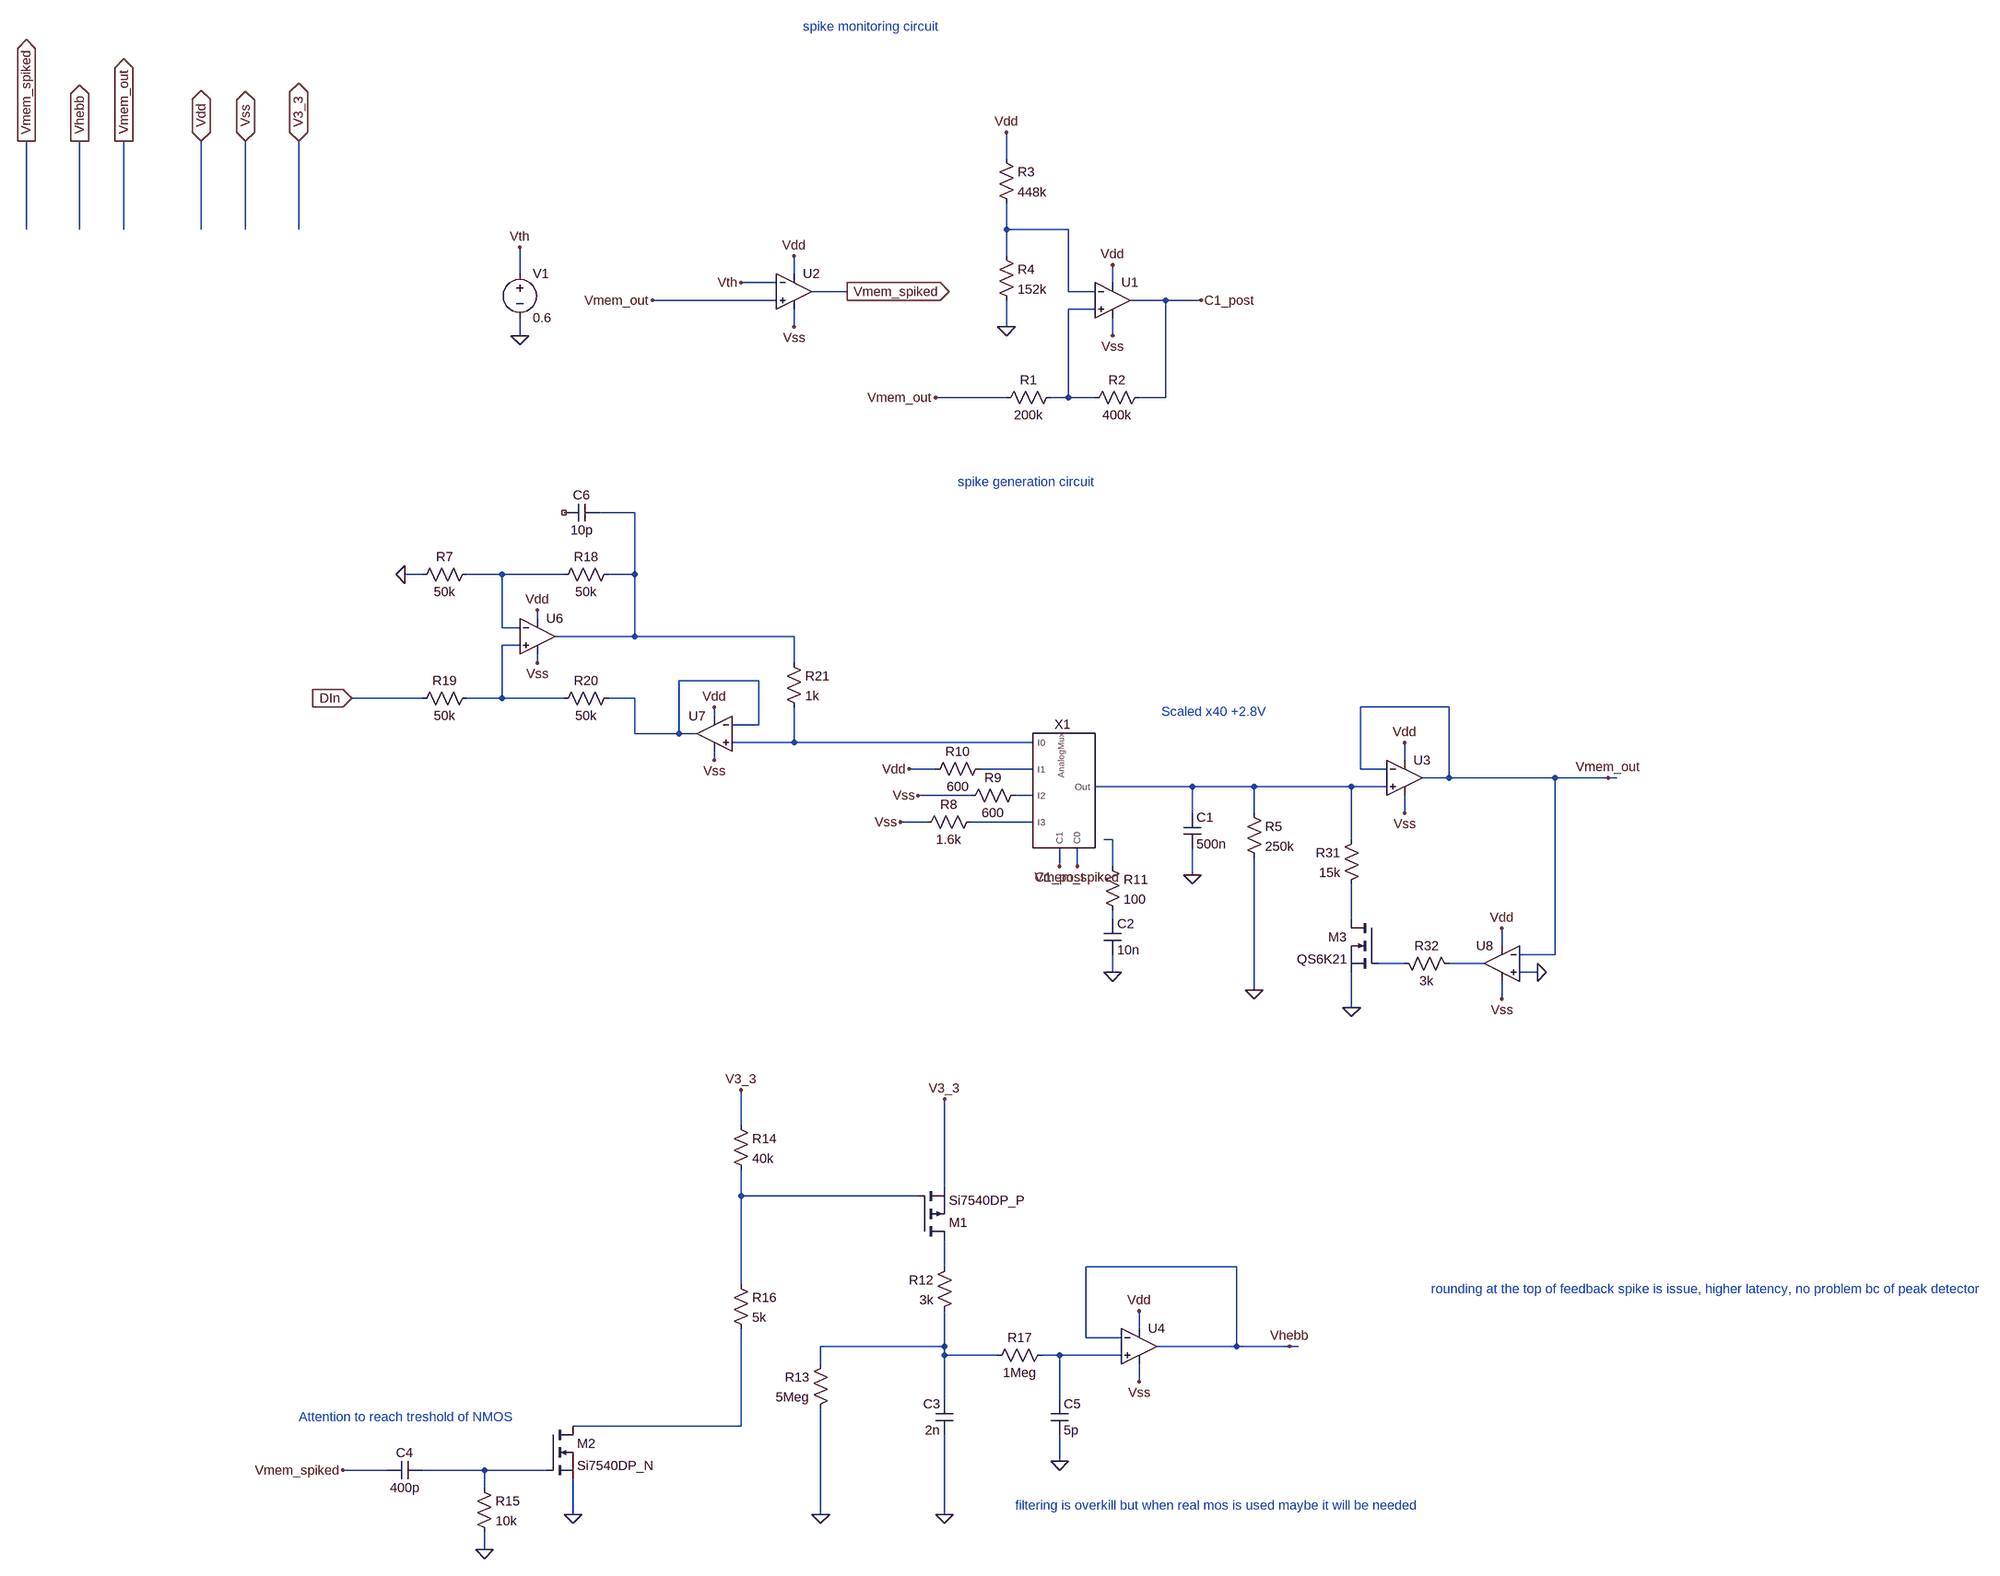
[diagram p0: schematic Digital_to_Spike.asc]
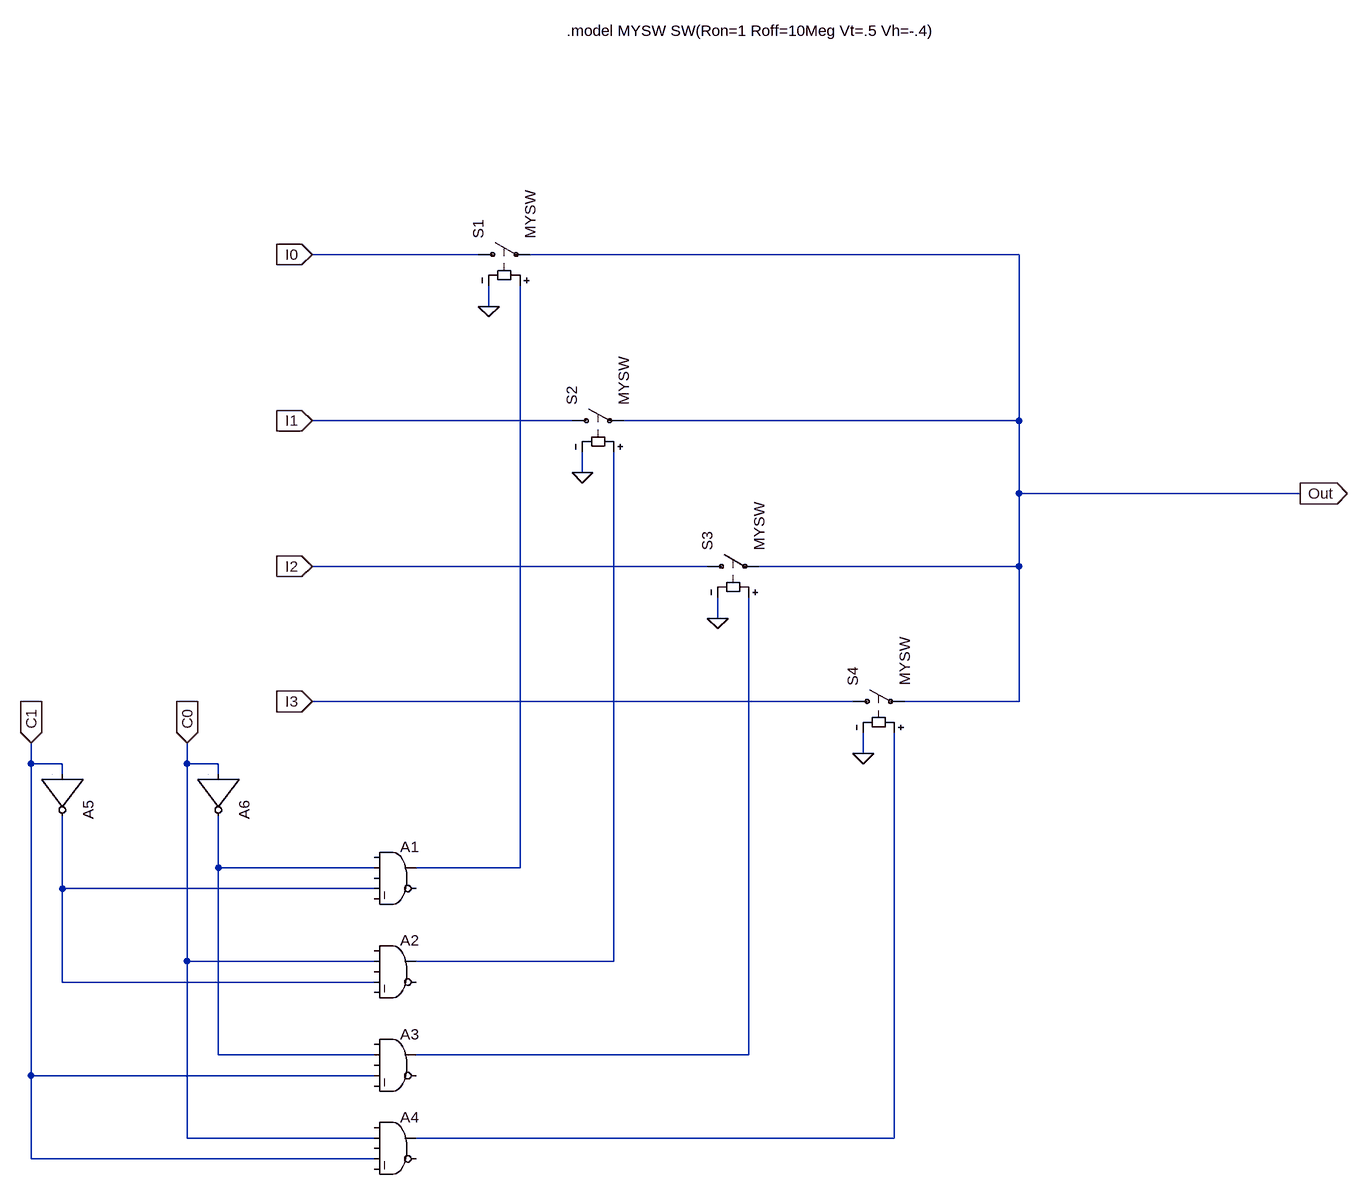
[diagram p1: sub-circuit analogmux.asc]
Digital_to_Spike.asc, the LTspice schematic file:
Version 4
SHEET 1 3772 2324
WIRE 1920 -1296 1920 -1344
WIRE 128 -1168 128 -1328
WIRE 224 -1168 224 -1328
WIRE 304 -1168 304 -1328
WIRE 464 -1168 464 -1328
WIRE 544 -1168 544 -1328
WIRE 640 -1168 640 -1328
WIRE 1920 -1168 1920 -1216
WIRE 2032 -1168 1920 -1168
WIRE 1920 -1120 1920 -1168
WIRE 1040 -1088 1040 -1136
WIRE 1536 -1088 1536 -1120
WIRE 1504 -1072 1440 -1072
WIRE 2112 -1072 2112 -1104
WIRE 1632 -1056 1568 -1056
WIRE 2032 -1056 2032 -1168
WIRE 2080 -1056 2032 -1056
WIRE 1504 -1040 1280 -1040
WIRE 2208 -1040 2144 -1040
WIRE 2272 -1040 2208 -1040
WIRE 2080 -1024 2032 -1024
WIRE 1536 -992 1536 -1024
WIRE 1920 -992 1920 -1040
WIRE 1040 -976 1040 -1008
WIRE 2112 -976 2112 -1008
WIRE 1920 -864 1792 -864
WIRE 2032 -864 2032 -1024
WIRE 2032 -864 2000 -864
WIRE 2080 -864 2032 -864
WIRE 2208 -864 2208 -1040
WIRE 2208 -864 2160 -864
WIRE 1248 -544 1184 -544
WIRE 864 -432 832 -432
WIRE 1008 -432 944 -432
WIRE 1120 -432 1008 -432
WIRE 1248 -432 1248 -544
WIRE 1248 -432 1200 -432
WIRE 1072 -352 1072 -368
WIRE 1008 -336 1008 -432
WIRE 1040 -336 1008 -336
WIRE 1248 -320 1248 -432
WIRE 1248 -320 1104 -320
WIRE 1536 -320 1248 -320
WIRE 1040 -304 1008 -304
WIRE 1072 -272 1072 -288
WIRE 1536 -272 1536 -320
WIRE 1472 -240 1328 -240
WIRE 864 -208 736 -208
WIRE 1008 -208 1008 -304
WIRE 1008 -208 944 -208
WIRE 1120 -208 1008 -208
WIRE 1248 -208 1200 -208
WIRE 2720 -192 2560 -192
WIRE 1392 -176 1392 -192
WIRE 1472 -160 1472 -240
WIRE 1472 -160 1424 -160
WIRE 1248 -144 1248 -208
WIRE 1328 -144 1328 -240
WIRE 1328 -144 1248 -144
WIRE 1360 -144 1328 -144
WIRE 1536 -128 1536 -192
WIRE 1536 -128 1424 -128
WIRE 1968 -128 1536 -128
WIRE 1392 -96 1392 -112
WIRE 2640 -96 2640 -128
WIRE 1792 -80 1744 -80
WIRE 1968 -80 1872 -80
WIRE 2560 -80 2560 -192
WIRE 2608 -80 2560 -80
WIRE 2720 -64 2720 -192
WIRE 2720 -64 2672 -64
WIRE 2912 -64 2720 -64
WIRE 3008 -64 2912 -64
WIRE 3024 -64 3008 -64
WIRE 2256 -48 2080 -48
WIRE 2368 -48 2256 -48
WIRE 2544 -48 2368 -48
WIRE 2608 -48 2544 -48
WIRE 1856 -32 1760 -32
WIRE 1968 -32 1936 -32
WIRE 2256 0 2256 -48
WIRE 2368 0 2368 -48
WIRE 2640 0 2640 -32
WIRE 1776 16 1728 16
WIRE 1968 16 1856 16
WIRE 2112 48 2096 48
WIRE 2544 48 2544 -48
WIRE 2016 96 2016 64
WIRE 2048 96 2048 64
WIRE 2112 96 2112 48
WIRE 2256 112 2256 64
WIRE 2112 192 2112 176
WIRE 2544 192 2544 128
WIRE 2816 240 2816 208
WIRE 2912 256 2912 -64
WIRE 2912 256 2848 256
WIRE 2640 272 2592 272
WIRE 2784 272 2720 272
WIRE 2112 288 2112 256
WIRE 2880 288 2848 288
WIRE 2368 320 2368 80
WIRE 2816 336 2816 304
WIRE 2544 352 2544 288
WIRE 1440 640 1440 576
WIRE 1808 752 1808 592
WIRE 1440 768 1440 720
WIRE 1760 768 1440 768
WIRE 1808 896 1808 848
WIRE 2336 896 2064 896
WIRE 1440 928 1440 768
WIRE 2160 1008 2160 976
WIRE 2064 1024 2064 896
WIRE 2128 1024 2064 1024
WIRE 1808 1040 1808 976
WIRE 1808 1040 1584 1040
WIRE 2336 1040 2336 896
WIRE 2336 1040 2192 1040
WIRE 2432 1040 2336 1040
WIRE 2448 1040 2432 1040
WIRE 1808 1056 1808 1040
WIRE 1904 1056 1808 1056
WIRE 2016 1056 1984 1056
WIRE 2128 1056 2016 1056
WIRE 1584 1072 1584 1040
WIRE 2160 1104 2160 1072
WIRE 1808 1136 1808 1056
WIRE 2016 1136 2016 1056
WIRE 1440 1184 1440 1008
WIRE 1440 1184 1136 1184
WIRE 2016 1248 2016 1200
WIRE 800 1264 720 1264
WIRE 976 1264 864 1264
WIRE 1088 1264 976 1264
WIRE 976 1296 976 1264
WIRE 1136 1344 1136 1280
WIRE 1584 1344 1584 1152
WIRE 1808 1344 1808 1200
WIRE 976 1408 976 1376
FLAG 1920 -992 0
FLAG 1920 -1344 Vdd
FLAG 2112 -1104 Vdd
FLAG 2112 -976 Vss
FLAG 1536 -1120 Vdd
FLAG 1536 -992 Vss
FLAG 1040 -976 0
FLAG 1040 -1136 Vth
FLAG 1440 -1072 Vth
FLAG 2256 112 0
FLAG 3008 -64 Vmem_out
FLAG 1792 -864 Vmem_out
FLAG 1632 -1056 Vmem_spiked
IOPIN 1632 -1056 Out
FLAG 2048 96 Vmem_spiked
FLAG 2016 96 C1_post
FLAG 2272 -1040 C1_post
FLAG 1744 -80 Vdd
FLAG 1760 -32 Vss
FLAG 1728 16 Vss
FLAG 2640 -128 Vdd
FLAG 2640 0 Vss
FLAG 2112 288 0
FLAG 1808 1344 0
FLAG 2160 1104 Vss
FLAG 2160 976 Vdd
FLAG 1584 1344 0
FLAG 1136 1344 0
FLAG 720 1264 Vmem_spiked
FLAG 976 1408 0
FLAG 2016 1248 0
FLAG 1440 576 V3_3
FLAG 1808 592 V3_3
FLAG 2432 1040 Vhebb
FLAG 1280 -1040 Vmem_out
FLAG 2544 352 0
FLAG 2816 208 Vdd
FLAG 2816 336 Vss
FLAG 2880 288 0
FLAG 736 -208 DIn
IOPIN 736 -208 In
FLAG 464 -1328 Vdd
IOPIN 464 -1328 BiDir
FLAG 544 -1328 Vss
IOPIN 544 -1328 BiDir
FLAG 640 -1328 V3_3
IOPIN 640 -1328 BiDir
FLAG 128 -1328 Vmem_spiked
IOPIN 128 -1328 Out
FLAG 224 -1328 Vhebb
IOPIN 224 -1328 Out
FLAG 304 -1328 Vmem_out
IOPIN 304 -1328 Out
FLAG 2368 320 0
FLAG 1072 -272 Vss
FLAG 1392 -96 Vss
FLAG 832 -432 0
FLAG 1072 -368 Vdd
FLAG 1392 -192 Vdd
SYMBOL AnalogMux 2016 -48 R0
SYMATTR InstName X1
SYMBOL OpAmps\\UniversalOpAmp2 2112 -1040 R0
SYMATTR InstName U1
SYMBOL res 2016 -880 R90
WINDOW 0 0 56 VBottom 2
WINDOW 3 32 56 VTop 2
SYMATTR InstName R1
SYMATTR Value 200k
SYMBOL res 2176 -880 R90
WINDOW 0 0 56 VBottom 2
WINDOW 3 32 56 VTop 2
SYMATTR InstName R2
SYMATTR Value 400k
SYMBOL res 1904 -1312 R0
SYMATTR InstName R3
SYMATTR Value 448k
SYMBOL res 1904 -1136 R0
SYMATTR InstName R4
SYMATTR Value 152k
SYMBOL OpAmps\\UniversalOpAmp2 1536 -1056 R0
SYMATTR InstName U2
SYMBOL voltage 1040 -1104 R0
WINDOW 123 0 0 Left 0
WINDOW 39 0 0 Left 0
SYMATTR InstName V1
SYMATTR Value 0.6
SYMBOL cap 2240 0 R0
SYMATTR InstName C1
SYMATTR Value 500n
SYMBOL res 2352 -16 R0
SYMATTR InstName R5
SYMATTR Value 250k
SYMBOL res 1872 0 R90
WINDOW 0 0 56 VBottom 2
WINDOW 3 32 56 VTop 2
SYMATTR InstName R8
SYMATTR Value 1.6k
SYMBOL res 1952 -48 R90
WINDOW 0 0 56 VBottom 2
WINDOW 3 32 56 VTop 2
SYMATTR InstName R9
SYMATTR Value 600
SYMBOL res 1888 -96 R90
WINDOW 0 0 56 VBottom 2
WINDOW 3 32 56 VTop 2
SYMATTR InstName R10
SYMATTR Value 600
SYMBOL OpAmps\\UniversalOpAmp2 2640 -64 R0
SYMATTR InstName U3
SYMBOL cap 2096 192 R0
SYMATTR InstName C2
SYMATTR Value 10n
SYMBOL res 2096 80 R0
SYMATTR InstName R11
SYMATTR Value 100
SYMBOL pmos 1760 848 M180
SYMATTR InstName M1
SYMATTR Value Si7540DP_P
SYMBOL cap 1824 1136 M0
SYMATTR InstName C3
SYMATTR Value 2n
SYMATTR SpiceLine Rser=50
SYMBOL res 1824 880 M0
SYMATTR InstName R12
SYMATTR Value 3k
SYMBOL res 1600 1056 M0
SYMATTR InstName R13
SYMATTR Value 5Meg
SYMBOL OpAmps\\UniversalOpAmp2 2160 1040 R0
SYMATTR InstName U4
SYMBOL res 1424 624 R0
SYMATTR InstName R14
SYMATTR Value 40k
SYMBOL nmos 1088 1184 R0
SYMATTR InstName M2
SYMATTR Value Si7540DP_N
SYMBOL cap 864 1248 R90
WINDOW 0 0 32 VBottom 2
WINDOW 3 32 32 VTop 2
SYMATTR InstName C4
SYMATTR Value 400p
SYMATTR SpiceLine Rser=10
SYMBOL res 960 1280 R0
SYMATTR InstName R15
SYMATTR Value 10k
SYMBOL res 1424 912 R0
SYMATTR InstName R16
SYMATTR Value 5k
SYMBOL res 2000 1040 R90
WINDOW 0 0 56 VBottom 2
WINDOW 3 32 56 VTop 2
SYMATTR InstName R17
SYMATTR Value 1Meg
SYMBOL cap 2000 1136 R0
SYMATTR InstName C5
SYMATTR Value 5p
SYMBOL nmos 2592 192 M0
SYMATTR InstName M3
SYMATTR Value QS6K21
SYMBOL res 2560 32 M0
SYMATTR InstName R31
SYMATTR Value 15k
SYMBOL OpAmps\\UniversalOpAmp2 2816 272 M0
SYMATTR InstName U8
SYMBOL res 2624 256 M90
WINDOW 0 0 56 VBottom 2
WINDOW 3 32 56 VTop 2
SYMATTR InstName R32
SYMATTR Value 3k
SYMBOL OpAmps\\UniversalOpAmp2 1072 -320 R0
SYMATTR InstName U6
SYMBOL res 960 -448 R90
WINDOW 0 0 56 VBottom 2
WINDOW 3 32 56 VTop 2
SYMATTR InstName R7
SYMATTR Value 50k
SYMBOL res 1216 -448 R90
WINDOW 0 0 56 VBottom 2
WINDOW 3 32 56 VTop 2
SYMATTR InstName R18
SYMATTR Value 50k
SYMBOL res 960 -224 R90
WINDOW 0 0 56 VBottom 2
WINDOW 3 32 56 VTop 2
SYMATTR InstName R19
SYMATTR Value 50k
SYMBOL res 1216 -224 R90
WINDOW 0 0 56 VBottom 2
WINDOW 3 32 56 VTop 2
SYMATTR InstName R20
SYMATTR Value 50k
SYMBOL OpAmps\\UniversalOpAmp2 1392 -144 M0
SYMATTR InstName U7
SYMBOL res 1520 -288 R0
SYMATTR InstName R21
SYMATTR Value 1k
SYMBOL cap 1184 -560 R90
WINDOW 0 0 32 VBottom 2
WINDOW 3 32 32 VTop 2
SYMATTR InstName C6
SYMATTR Value 10p
TEXT 2200 -184 Left 2 ;Scaled x40 +2.8V
TEXT 1936 1328 Left 2 ;filtering is overkill but when real mos is used maybe it will be needed
TEXT 2688 936 Left 2 ;rounding at the top of feedback spike is issue, higher latency, no problem bc of peak detector
TEXT 640 1168 Left 2 ;Attention to reach treshold of NMOS
TEXT 1552 -1536 Left 2 ;spike monitoring circuit
TEXT 1832 -600 Left 2 ;spike generation circuit

analogmux.asc, the sub-circuit schematic file:
Version 4
SHEET 1 1540 1496
WIRE 176 16 -80 16
WIRE 1008 16 256 16
WIRE 192 96 192 64
WIRE 320 272 -80 272
WIRE 1008 272 1008 16
WIRE 1008 272 400 272
WIRE 336 352 336 320
WIRE 1008 384 1008 272
WIRE 1440 384 1008 384
WIRE 528 496 -80 496
WIRE 1008 496 1008 384
WIRE 1008 496 608 496
WIRE 544 576 544 544
WIRE 752 704 -80 704
WIRE 1008 704 1008 496
WIRE 1008 704 832 704
WIRE 768 784 768 752
WIRE -512 800 -512 768
WIRE -464 800 -512 800
WIRE -272 800 -272 768
WIRE -224 800 -272 800
WIRE -464 816 -464 800
WIRE -224 816 -224 800
WIRE -224 960 -224 880
WIRE 16 960 -224 960
WIRE 240 960 240 64
WIRE 240 960 80 960
WIRE -464 992 -464 880
WIRE 16 992 -464 992
WIRE -272 1104 -272 800
WIRE 16 1104 -272 1104
WIRE 384 1104 384 320
WIRE 384 1104 80 1104
WIRE -464 1136 -464 992
WIRE 16 1136 -464 1136
WIRE -224 1248 -224 960
WIRE 16 1248 -224 1248
WIRE 592 1248 592 544
WIRE 592 1248 80 1248
WIRE -512 1280 -512 800
WIRE 16 1280 -512 1280
WIRE -272 1376 -272 1104
WIRE 16 1376 -272 1376
WIRE 816 1376 816 752
WIRE 816 1376 80 1376
WIRE -512 1408 -512 1280
WIRE 16 1408 -512 1408
FLAG 336 352 0
FLAG 544 576 0
FLAG 768 784 0
FLAG -512 768 C1
IOPIN -512 768 In
FLAG -272 768 C0
IOPIN -272 768 In
FLAG -80 16 I0
IOPIN -80 16 In
FLAG -80 272 I1
IOPIN -80 272 In
FLAG -80 496 I2
IOPIN -80 496 In
FLAG -80 704 I3
IOPIN -80 704 In
FLAG 1440 384 Out
IOPIN 1440 384 Out
FLAG 192 96 0
SYMBOL sw 160 16 R270
SYMATTR InstName S1
SYMATTR Value MYSW
SYMBOL sw 304 272 R270
SYMATTR InstName S2
SYMATTR Value MYSW
SYMBOL sw 512 496 R270
SYMATTR InstName S3
SYMATTR Value MYSW
SYMBOL sw 736 704 R270
SYMATTR InstName S4
SYMATTR Value MYSW
SYMBOL Digital\\and 48 912 R0
SYMATTR InstName A1
SYMBOL Digital\\and 48 1056 R0
SYMATTR InstName A2
SYMBOL Digital\\and 48 1200 R0
SYMATTR InstName A3
SYMBOL Digital\\and 48 1328 R0
SYMATTR InstName A4
SYMBOL Digital\\inv -400 816 R90
SYMATTR InstName A5
SYMBOL Digital\\inv -160 816 R90
SYMATTR InstName A6
TEXT 312 -328 Left 2 !.model MYSW SW(Ron=1 Roff=10Meg Vt=.5 Vh=-.4)

The netlist it stands for:
* Digital_to_Spike.asc
XX1 Vmem_spiked C1_post N007 N008 N010 N011 N009 analogmux
XU1 N002 N001 Vdd Vss C1_post level2 Avol=1Meg GBW=10Meg Slew=10Meg Ilimit=25m Rail=0 Vos=0 En=0 Enk=0 In=0 Ink=0 Rin=500Meg  ; pins In+ In- V+ V- OUT
R1 N002 Vmem_out 200k
R2 C1_post N002 400k
R3 Vdd N001 448k
R4 N001 0 152k
XU2 Vmem_out Vth Vdd Vss Vmem_spiked level2 Avol=1Meg GBW=10Meg Slew=10Meg Ilimit=25m Rail=0 Vos=0 En=0 Enk=0 In=0 Ink=0 Rin=500Meg  ; pins In+ In- V+ V- OUT
V1 Vth 0 0.6
C1 N009 0 500n
R5 N009 0 250k
R8 N011 Vss 1.6k
R9 N010 Vss 600
R10 N008 Vdd 600
XU3 N009 Vmem_out Vdd Vss Vmem_out level2 Avol=1Meg GBW=10Meg Slew=10Meg Ilimit=25m Rail=0 Vos=0 En=0 Enk=0 In=0 Ink=0 Rin=500Meg  ; pins In+ In- V+ V- OUT
C2 N013 0 10n
R11 N012 N013 100
M1 N018 N017 V3_3 V3_3 Si7540DP_P
C3 N019 0 2n Rser=50
R12 N018 N019 3k
R13 N019 0 5Meg
XU4 N020 Vhebb Vdd Vss Vhebb level2 Avol=1Meg GBW=10Meg Slew=10Meg Ilimit=25m Rail=0 Vos=0 En=0 Enk=0 In=0 Ink=0 Rin=500Meg  ; pins In+ In- V+ V- OUT
R14 V3_3 N017 40k
M2 N021 N022 0 0 Si7540DP_N
C4 N022 Vmem_spiked 400p Rser=10
R15 N022 0 10k
R16 N017 N021 5k
R17 N020 N019 1Meg
C5 N020 0 5p
M3 N014 N015 0 0 QS6K21
R31 N009 N014 15k
XU8 0 Vmem_out Vdd Vss N016 level2 Avol=1Meg GBW=10Meg Slew=10Meg Ilimit=25m Rail=0 Vos=0 En=0 Enk=0 In=0 Ink=0 Rin=500Meg  ; pins In+ In- V+ V- OUT
R32 N015 N016 3k
XU6 N005 N004 Vdd Vss N003 level2 Avol=1Meg GBW=10Meg Slew=10Meg Ilimit=25m Rail=0 Vos=0 En=0 Enk=0 In=0 Ink=0 Rin=500Meg  ; pins In+ In- V+ V- OUT
R7 N004 0 50k
R18 N003 N004 50k
R19 N005 DIn 50k
R20 N006 N005 50k
XU7 N007 N006 Vdd Vss N006 level2 Avol=1Meg GBW=10Meg Slew=10Meg Ilimit=25m Rail=0 Vos=0 En=0 Enk=0 In=0 Ink=0 Rin=500Meg  ; pins In+ In- V+ V- OUT
R21 N003 N007 1k
C6 N003 NC_01 10p

* block symbol definitions
.subckt analogmux C0 C1 I0 I1 I2 I3 Out
S1 I0 Out N002 0 MYSW
S2 I1 Out N004 0 MYSW
S3 I2 Out N005 0 MYSW
S4 I3 Out N006 0 MYSW
A1 0 N001 0 N003 0 0 N002 0 AND
A2 0 C0 0 N003 0 0 N004 0 AND
A3 0 N001 0 C1 0 0 N005 0 AND
A4 0 C0 0 C1 0 0 N006 0 AND
A5 C1 0 0 0 0 N003 0 0 BUF
A6 C0 0 0 0 0 N001 0 0 BUF
.model MYSW SW(Ron=1 Roff=10Meg Vt=.5 Vh=-.4)
.ends analogmux

.model NMOS NMOS
.model PMOS PMOS
.lib standard.mos
* Scaled x40 +2.8V
* filtering is overkill but when real mos is used maybe it will be needed
* rounding at the top of feedback spike is issue, higher latency, no problem bc of peak detector
* Attention to reach treshold of NMOS
* spike monitoring circuit
* spike generation circuit
.lib UniversalOpAmp2.lib
.backanno
.end